# EAGLE design Lin Final Project (EAGLE 9.6.2)
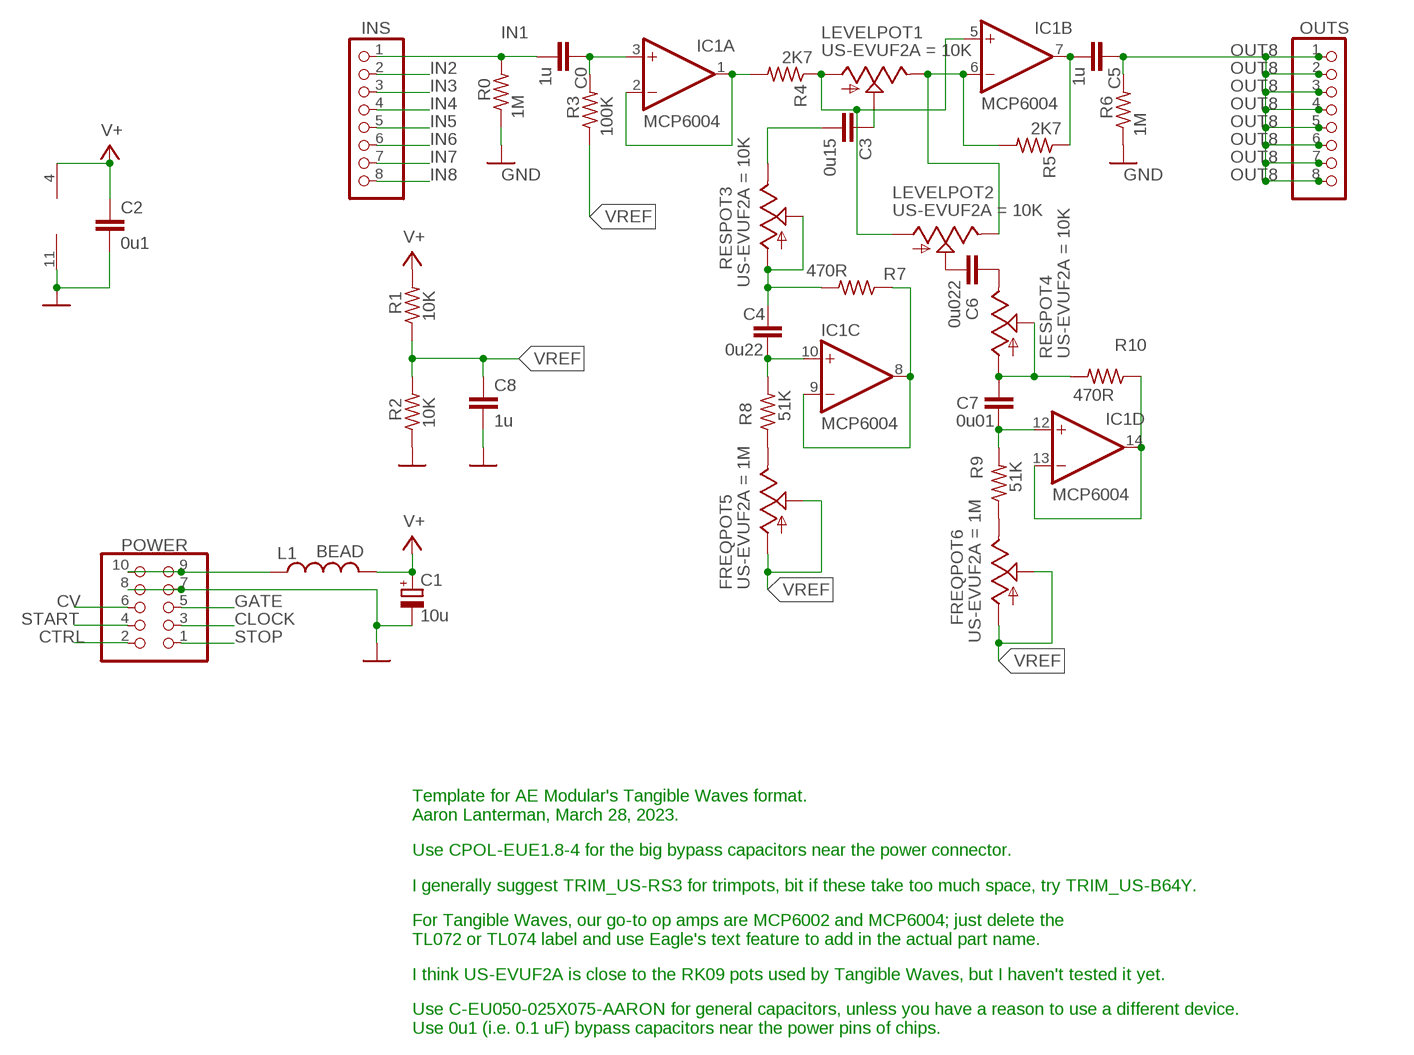
[diagram p0: schematic, sheet 1]

## Parts
C0  1u  C-EU050-025X075-AARON  [C050-025X075-AARON]
C1  10u  CPOL-EUE1.8-4  [E1,8-4]
C2  0u1  C-EU050-025X075-AARON  [C050-025X075-AARON]
C3  0u15  C-EU050-025X075-AARON  [C050-025X075-AARON]
C4  0u22  C-EU050-025X075-AARON  [C050-025X075-AARON]
C5  1u  C-EU050-025X075-AARON  [C050-025X075-AARON]
C6  0u022  C-EU050-025X075-AARON  [C050-025X075-AARON]
C7  0u01  C-EU050-025X075-AARON  [C050-025X075-AARON]
C8  1u  C-EU050-025X075-AARON  [C050-025X075-AARON]
FREQPOT5  US-EVUF2A  [EVUF]
FREQPOT6  US-EVUF2A  [EVUF]
IC1  TL074P  [DIL14]
INS  PINHD-1X8  [1X08]
L1  BEAD  L-US0207/10  [0207/10]
LEVELPOT1  US-EVUF2A  [EVUF]
LEVELPOT2  US-EVUF2A  [EVUF]
OUTS  PINHD-1X8  [1X08]
POWER  PINHD-2X5  [2X05]
R0  1M  R-US_0207/10  [0207/10]
R1  10K  R-US_0207/10  [0207/10]
R2  10K  R-US_0207/10  [0207/10]
R3  100K  R-US_0207/10  [0207/10]
R4  2K7  R-US_0207/10  [0207/10]
R5  2K7  R-US_0207/10  [0207/10]
R6  1M  R-US_0207/10  [0207/10]
R7  470R  R-US_0207/10  [0207/10]
R8  51K  R-US_0207/10  [0207/10]
R9  51K  R-US_0207/10  [0207/10]
R10  470R  R-US_0207/10  [0207/10]
RESPOT3  US-EVUF2A  [EVUF]
RESPOT4  US-EVUF2A  [EVUF]

## Nets
+5V: L1.1 POWER.9 POWER.10
CLOCK: POWER.3
CTRL: POWER.2
CV: POWER.6
GATE: POWER.5
GND: C1.- C2.2 C8.2 IC1.11(P:V-) POWER.7 POWER.8 R0.1 R2.1 R6.1
IN1: C0.2 INS.1 R0.2
IN2: INS.2
IN3: INS.3
IN4: INS.4
IN5: INS.5
IN6: INS.6
IN7: INS.7
IN8: INS.8
N$1: C0.1 IC1.3(A:+IN) R3.2
N$2: IC1.1(A:OUT) IC1.2(A:-IN) R4.2
N$4: C3.1 LEVELPOT1.2(S)
N$5: C4.1 R7.2 RESPOT3.1(A) RESPOT3.2(S)
N$6: C3.2 RESPOT3.3(E)
N$7: IC1.6(B:-IN) LEVELPOT1.3(E) LEVELPOT2.3(E) R5.2
N$8: C6.2 LEVELPOT2.2(S)
N$9: C5.2 IC1.7(B:OUT) R5.1
N$10: C6.1 RESPOT4.3(E)
N$11: C7.1 R10.2 RESPOT4.1(A) RESPOT4.2(S)
N$12: IC1.8(C:OUT) IC1.9(C:-IN) R7.1
N$13: FREQPOT5.3(E) R8.1
N$14: C4.2 IC1.10(C:+IN) R8.2
N$16: IC1.13(D:-IN) IC1.14(D:OUT) R10.1
N$17: C7.2 IC1.12(D:+IN) R9.2
N$18: FREQPOT6.3(E) R9.1
N$21: IC1.5(B:+IN) LEVELPOT1.1(A) LEVELPOT2.1(A) R4.1
OUT8: C5.1 OUTS.1 OUTS.2 OUTS.3 OUTS.4 OUTS.5 OUTS.6 OUTS.7 OUTS.8 R6.2
START: POWER.4
STOP: POWER.1
V+: C1.+ C2.1 IC1.4(P:V+) L1.2 R1.2
VREF: C8.1 FREQPOT5.1(A) FREQPOT5.2(S) FREQPOT6.1(A) FREQPOT6.2(S) R1.1 R2.2 R3.1

## Notes on the sheet
- Template for AE Modular's Tangible Waves format.
  Aaron Lanterman, March 28, 2023.
- Use CPOL-EUE1.8-4 for the big bypass capacitors near the power connector.
- I generally suggest TRIM_US-RS3 for trimpots, bit if these take too much space, try TRIM_US-B64Y.
- For Tangible Waves, our go-to op amps are MCP6002 and MCP6004; just delete the
  TL072 or TL074 label and use Eagle's text feature to add in the actual part name.
- I think US-EVUF2A is close to the RK09 pots used by Tangible Waves, but I haven't tested it yet.
- Use C-EU050-025X075-AARON for general capacitors, unless you have a reason to use a different device.
  Use 0u1 (i.e. 0.1 uF) bypass capacitors near the power pins of chips.

## Library data of the parts
C0 C2-C8 = aaroncaps:C-EU: CAPACITOR, European symbol
C1 = rcl:CPOL-EU: POLARIZED CAPACITOR, European symbol
FREQPOT5 FREQPOT6 = pot:US-EVU: 9 mm Square Rotary Potentiometers Source: Panasonic; US-EVUF2A: 1M
IC1 = linear:TL074: OP AMP
INS OUTS = pinhead:PINHD-1X8: PIN HEADER
L1 = rcl:L-US: INDUCTOR, American symbol; SPICEPREFIX: L
LEVELPOT1 LEVELPOT2 RESPOT3 RESPOT4 = pot:US-EVU: 9 mm Square Rotary Potentiometers Source: Panasonic; US-EVUF2A: 10K
POWER = pinhead:PINHD-2X5: PIN HEADER
R0 R1-R10 = rcl:R-US_: RESISTOR, American symbol

## Board
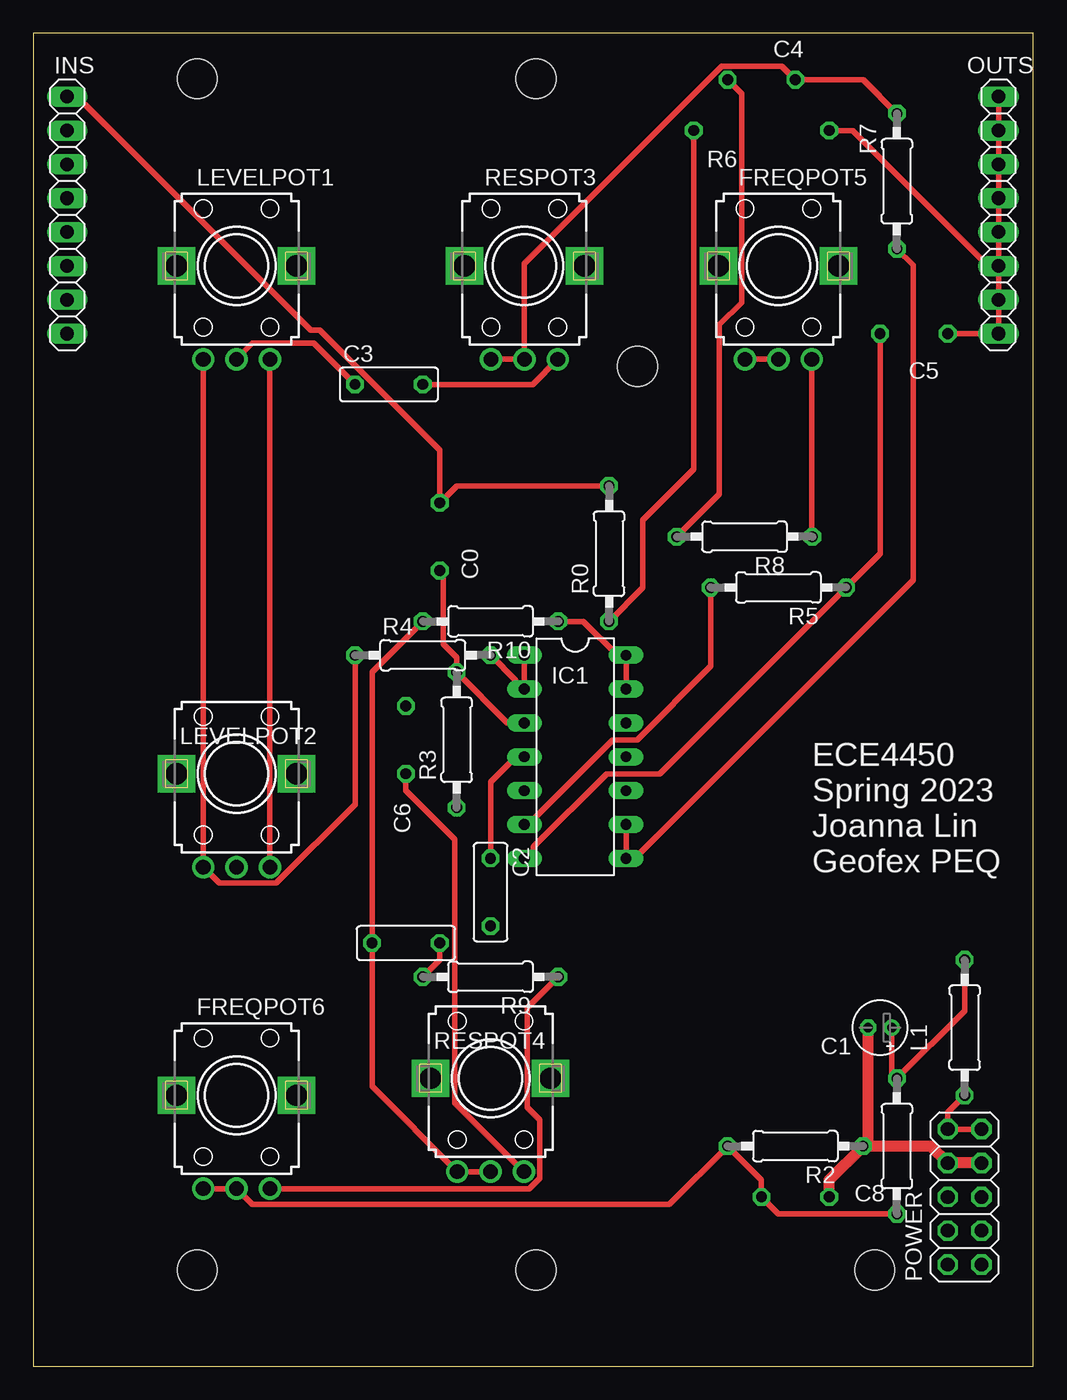
[diagram p1: board, top side]
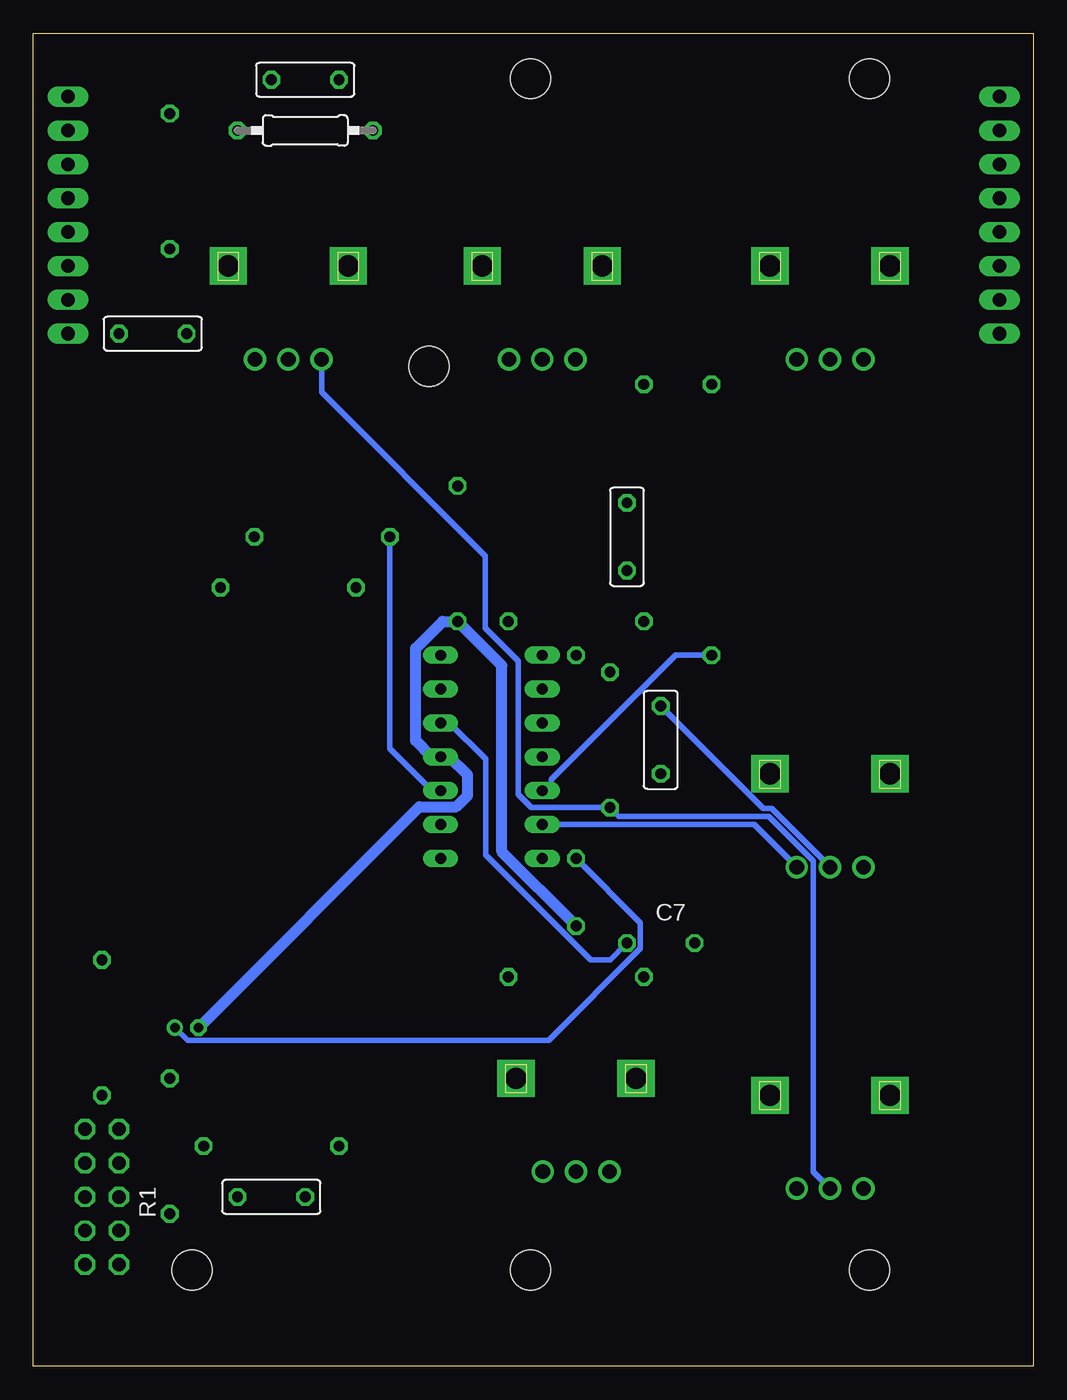
[diagram p2: board, bottom side, seen from below]

Size 75 x 100 mm. Coordinates in mm from the lower left corner, seen from the top.
Outline: 0,0 75,0 75,100 0,100 0,0
Copper layers (1*16): Top 0.035mm / dielectric 1.5mm / Bottom 0.035mm
Design rules "default": minimum track width 6mil, minimum drill 0.35mm, track to track 6mil, track to pad 6mil, pad to pad 6mil, via to via 6mil, smd to smd 6mil, copper to edge 40mil, drill to drill 6mil, minimum pad ring 10mil, minimum via ring 8mil, stop-mask expansion 4mil, vias tented up to drill 0mil, thermal gap 10mil
Holes 3 mm at 12.3,7.21 12.3,96.6 37.7,96.6 45.32,75.01 37.7,7.21 63.1,7.21

### Footprints (pad centres in the part's own frame; a part is rotated, then mirrored left to right if it is on the bottom)
C050-025X075-AARON = drill 0.813 octagon: 1 -2.54,0; 2 2.54,0
E1,8-4 = drill 0.711 pad 1.168: + -0.889,0 | drill 0.711 pad 1.168 octagon: - 0.889,0
EVUF = drill 1.1 pad 1.676: 1 -2.5,-7; 2 0,-7; 3 2.5,-7 | drill 1.6 pad 2.8 square: M1 4.5,0; M2 -4.5,0
DIL14 = drill 0.813 long: 1 -7.62,-3.81; 2 -5.08,-3.81; 3 -2.54,-3.81; 4 0,-3.81; 5 2.54,-3.81; 6 5.08,-3.81; 7 7.62,-3.81; 8 7.62,3.81; 9 5.08,3.81; 10 2.54,3.81; 11 0,3.81; 12 -2.54,3.81; 13 -5.08,3.81; 14 -7.62,3.81
1X08 = drill 1.016 long: 1 -8.89,0; 2 -6.35,0; 3 -3.81,0; 4 -1.27,0; 5 1.27,0; 6 3.81,0; 7 6.35,0; 8 8.89,0
0207/10 = drill 0.813 octagon: 1 -5.08,0; 2 5.08,0
2X05 = drill 1.016 octagon: 1 -5.08,-1.27; 2 -5.08,1.27; 3 -2.54,-1.27; 4 -2.54,1.27; 5 0,-1.27; 6 0,1.27; 7 2.54,-1.27; 8 2.54,1.27; 9 5.08,-1.27; 10 5.08,1.27

### Placement (x,y rotation side)
C0  30.48,62.23 90 bottom
C1  63.5,25.4 180 top
C2  34.29,35.56 270 top
C3  26.67,73.66 0 top
C4  54.61,96.52 0 bottom
C5  66.04,77.47 0 bottom
C6  27.94,46.99 90 bottom
C7  27.94,31.75 0 top
C8  57.15,12.7 180 bottom
FREQPOT5  55.88,82.55 0 top
FREQPOT6  15.24,20.32 0 top
IC1  40.64,45.72 270 top
INS  2.54,86.36 270 top
L1  69.85,25.4 90 top
LEVELPOT1  15.24,82.55 0 top
LEVELPOT2  15.24,44.45 0 top
OUTS  72.39,86.36 270 top
POWER  69.85,12.7 90 top
R0  43.18,60.96 90 top
R1  64.77,16.51 90 top
R2  57.15,16.51 180 top
R3  31.75,46.99 90 top
R4  29.21,53.34 0 top
R5  55.88,58.42 180 top
R6  54.61,92.71 180 bottom
R7  64.77,88.9 90 top
R8  53.34,62.23 180 top
R9  34.29,29.21 180 top
R10  34.29,55.88 180 top
RESPOT3  36.83,82.55 0 top
RESPOT4  34.29,21.59 0 top

### Tracks (layer width: path | path; a pad name or v marks a point on that pad's centre or on a via)
+5V
  Top 0.406: POWER.9 POWER.10 68.58,19.05 L1.1
GND
  Top 0.406: R6.1 49.53,67.31 45.72,63.5 45.72,58.42 R0.1
  Top 0.813: R2.1 67.31,16.51 POWER.8 POWER.7 | C8.2 59.69,13.97 R2.1 | R2.1 62.61,16.89 C1.-
  Bottom 0.813: C2.2 39.86,38.59 39.86,52.56 R0.1 44.3,55.88 46.33,53.84 46.33,46.94 45.11,45.72 IC1.11 43.79,45.72 42.43,44.36 42.43,42.81 43.28,41.96 46.05,41.96 C1.-
IN1
  Top 0.406: R0.2 31.75,66.04 C0.2 30.48,68.75 21.49,77.73 20.82,77.73 3.3,95.25 INS.1
N$1
  Top 0.406: IC1.3 35.56,48.26 R3.2 31.75,53.17 30.73,54.19 30.73,59.44 C0.1
N$2
  Top 0.406: IC1.1 IC1.2 36.17,50.8 36.17,51.46 R4.2
N$4
  Top 0.406: C3.1 21.05,76.74 16.43,76.74 LEVELPOT1.2
N$5
  Top 0.406: RESPOT3.1 RESPOT3.2 36.83,82.72 51.65,97.54 56.13,97.54 C4.1 62.23,96.52 R7.2
N$6
  Top 0.406: RESPOT3.3 37.44,73.66 C3.2
N$7
  Top 0.406: R5.2 50.8,52.51 45.28,46.99 43.46,46.99 37.49,41.02 37.49,40.64 IC1.6 | LEVELPOT2.3 LEVELPOT1.3
  Bottom 0.406: IC1.6 20.93,40.64 LEVELPOT2.3
N$8
  Bottom 0.406: LEVELPOT2.2 19.64,41.84 20.25,41.84 C6.2
N$9
  Top 0.406: IC1.7 37.49,38.1 37.49,38.95 42.99,44.45 46.99,44.45 R5.1 63.5,60.96 C5.2
N$10
  Top 0.406: RESPOT4.3 31.61,19.77 31.61,39.51 27.94,43.18 C6.1
N$11
  Top 0.406: RESPOT4.2 RESPOT4.1 25.4,20.98 C7.1 25.4,52.07 R10.2
N$12
  Top 0.406: IC1.9 IC1.8 45.11,38.1 65.99,58.98 65.99,82.6 R7.1
N$13
  Top 0.406: FREQPOT5.3 58.38,62.27 R8.1
N$14
  Top 0.406: R8.2 51.46,65.43 51.46,78.13 53.14,79.81 53.14,95.45 C4.2
  Bottom 0.406: R8.2 48.26,46.33 45.11,43.18 IC1.10
N$16
  Top 0.406: IC1.13 IC1.14 43.79,53.34 41.25,55.88 R10.1
N$17
  Top 0.406: C7.2 30.48,30.48 R9.2
  Bottom 0.406: IC1.12 43.79,48.26 41.07,45.54 41.07,38.37 33.19,30.48 31.75,30.48 C7.2
N$18
  Top 0.406: R9.1 37.03,26.87 37.03,19.42 37.98,18.47 37.98,14.1 37.21,13.32 FREQPOT6.3
N$21
  Top 0.406: R4.1 24.13,42.15 18.23,36.26 13.93,36.26 LEVELPOT2.1 LEVELPOT1.1
  Bottom 0.406: IC1.5 36.17,43.18 36.17,44.01 26.84,53.34 R4.1
OUT8
  Top 0.406: OUTS.1 OUTS.2 OUTS.3 OUTS.4 | OUTS.4 OUTS.5 OUTS.6 | OUTS.6 OUTS.7 OUTS.8 C5.1 | OUTS.6 OUTS.4 | OUTS.6 71.63,82.55 61.47,92.71 R6.2
V+
  Top 0.406: IC1.4 36.17,45.72 34.29,43.84 C2.1 | C1.+ 64.39,21.97 R1.2 69.85,26.67 L1.2
  Bottom 0.406: C2.1 29.46,33.27 29.46,31.33 36.36,24.43 63.42,24.43 C1.+
VREF
  Top 0.406: FREQPOT6.1 FREQPOT6.2 16.43,12.13 47.69,12.13 R2.2 54.61,13.97 C8.1 55.88,11.43 R1.1 | FREQPOT5.1 FREQPOT5.2
  Bottom 0.406: FREQPOT5.1 53.38,73.06 41.11,60.79 41.11,55.38 38.64,52.91 38.64,42.89 37.66,41.91 R3.1 31.08,41.24 19.84,41.24 16.49,37.89 16.49,14.57 FREQPOT6.2

### Text on the board
tNames: ECE4450 / Spring 2023 / Joanna Lin / Geofex PEQ